# Altium schematic sheet Mega2560原理图.SchDoc: Atmega2560-AU
size 406 x 317 mm
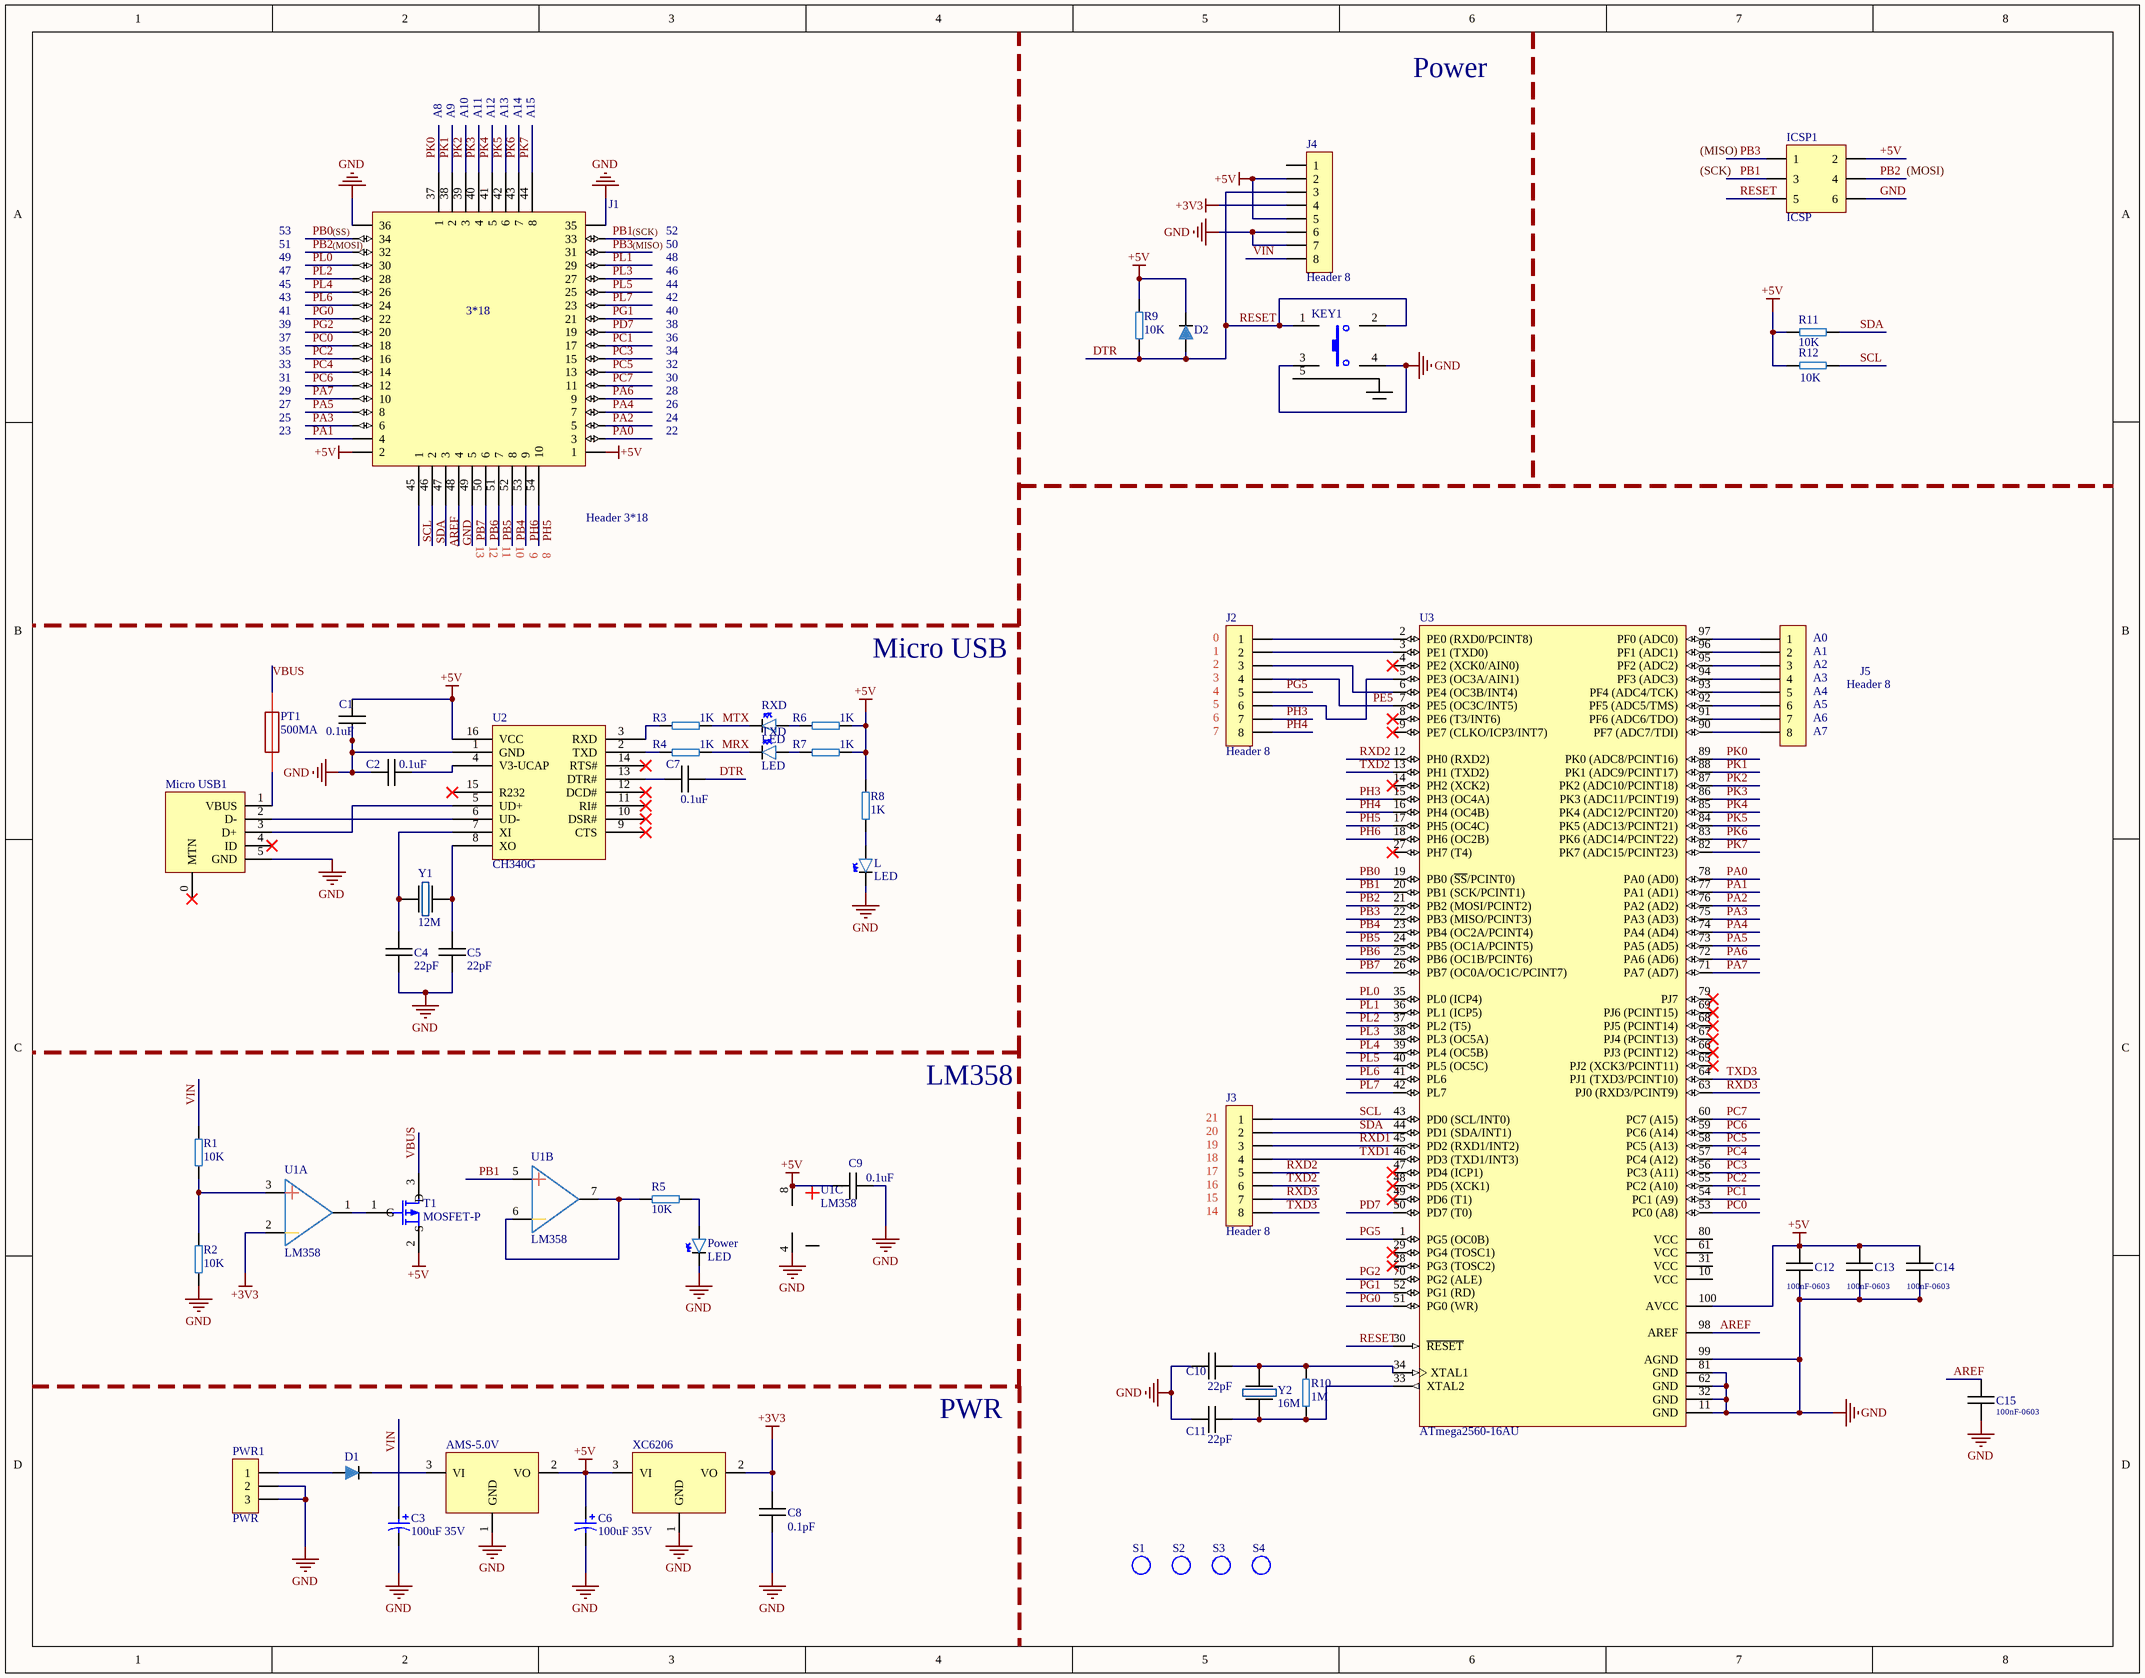
[diagram p0: Mega2560原理图.SchDoc]

## Parts
AMS-5.0V  AMS1117-5.0  [AMS1117-5.0v]  (value not drawn)
C1  0.1uF  [0805]
C2  0.1uF  [0805]
C3  100uF 35V  [极性电容]
C4  22pF  [0805]
C5  22pF  [0805]
C6  100uF 35V  [极性电容]
C7  0.1uF  [0805]
C8  0.1pF  [0805]
C9  0.1uF  [0805]
C10  22pF  [0805]
C11  22pF  [0805]
C12  100nF-0603  [0603_CAP]
C13  100nF-0603  [0603_CAP]
C14  100nF-0603  [0603_CAP]
C15  100nF-0603  [0603_CAP]
D1  二极管  [1206 正负]  (value not drawn)
D2  二极管  [1206 正负]  (value not drawn)
ICSP1  ICSP  [排针 2*3 PIN]
J1  Header 3*18  [排针 3*18 PIN]
J2  Header 8  [排针 8 PIN]
J3  Header 8  [排针 8 PIN]
J4  Header 8  [排针 8 PIN]
J5  Header 8  [排针 8 PIN]
KEY1  按键  [按键]  (value not drawn)
L  LED  [0805 - LED]
Micro_USB1  Micro USB  [MICRO-USB]  (value not drawn)
Power  LED  [0805 - LED]
PT1  500MA  [0805]
PWR1  PWR  [DC电源]
R1  10K  [0805]
R2  10K  [0805]
R3  1K  [0805]
R4  1K  [0805]
R5  10K  [0805]
R6  1K  [0805]
R7  1K  [0805]
R8  1K  [0805]
R9  10K  [0805]
R10  1M  [0805]
R11  10K  [0805]
R12  10K  [0805]
RXD  LED  [0805 - LED]
S1  散热孔  [散热孔]  (value not drawn)
S2  散热孔  [散热孔]  (value not drawn)
S3  散热孔  [散热孔]  (value not drawn)
S4  散热孔  [散热孔]  (value not drawn)
T1  MOSFET-P  [SI2301]
TXD  LED  [0805 - LED]
U1  LM358  [LM358]  (parts A,B,C of 3)
U2  CH340G  [CH340G]
U3  ATmega2560-16AU  [ATMEGA2560-AU]
XC6206  XC6206P332  [XC6206P332-3.3v]  (value not drawn)
Y1  12M  [贴片晶振]
Y2  16M  [贴片晶振]

## Nets
+3V3: C8.2 J4.4 U1.2 XC6206.2(VO)
+5V: AMS-5.0V.2(VO) C1.2 C6.1 C9.1 C12.2 C13.2 C14.2 D2.2 ICSP1.2 J1.1 J1.2 J4.2 J4.5 R6.2 R7.2 R8.2 R9.2 R11.2 R12.2 T1.2(S) U1.8 U2.16(VCC) U3.100(AVCC) XC6206.3(VI)
GND: AMS-5.0V.1(GND) C1.1 C2.1 C3.2 C4.1 C5.1 C6.2 C8.1 C9.2 C10.2 C11.2 C12.1 C13.1 C14.1 C15.1 ICSP1.6 J1.35 J1.36 J1.48(4) J4.6 J4.7 KEY1.3 KEY1.4 L.2 Micro_USB1.5(GND) Power.2 PWR1.2 PWR1.3 R2.1 U1.4 U2.1(GND) U3.11(GND) U3.32(GND) U3.62(GND) U3.81(GND) U3.99(AGND) XC6206.1(GND)
AREF: C15.2 J1.47(3) U3.98(AREF)
DTR: C7.1 D2.1 ICSP1.5 J4.3 KEY1.1 KEY1.2 R9.1 U3.30(~{RESET})  [also labelled RESET]
MRX: R4.2 TXD.2
MTX: R3.2 RXD.2
PA0: J1.3 U3.78(PA0_(AD0))
PA1: J1.4 U3.77(PA1_(AD1))
PA2: J1.5 U3.76(PA2_(AD2))
PA3: J1.6 U3.75(PA3_(AD3))
PA4: J1.7 U3.74(PA4_(AD4))
PA5: J1.8 U3.73(PA5_(AD5))
PA6: J1.9 U3.72(PA6_(AD6))
PA7: J1.10 U3.71(PA7_(AD7))
PB0: J1.34 U3.19(PB0_(~{SS}/PCINT0))
PB1: ICSP1.3 J1.33 U1.5 U3.20(PB1_(SCK/PCINT1))
PB2: ICSP1.4 J1.32 U3.21(PB2_(MOSI/PCINT2))
PB3: ICSP1.1 J1.31 U3.22(PB3_(MISO/PCINT3))
PB4: J1.52(8) U3.23(PB4_(OC2A/PCINT4))
PB5: J1.51(7) U3.24(PB5_(OC1A/PCINT5))
PB6: J1.50(6) U3.25(PB6_(OC1B/PCINT6))
PB7: J1.49(5) U3.26(PB7_(OC0A/OC1C/PCINT7))
PC0: J1.18 U3.53(PC0_(A8))
PC1: J1.17 U3.54(PC1_(A9))
PC2: J1.16 U3.55(PC2_(A10))
PC3: J1.15 U3.56(PC3_(A11))
PC4: J1.14 U3.57(PC4_(A12))
PC5: J1.13 U3.58(PC5_(A13))
PC6: J1.12 U3.59(PC6_(A14))
PC7: J1.11 U3.60(PC7_(A15))
PD7: J1.19 U3.50(PD7_(T0))
PE5: J2.4 U3.7(PE5_(OC3C/INT5))
PG0: J1.22 U3.51(PG0_(WR))
PG1: J1.21 U3.52(PG1_(RD))
PG2: J1.20 U3.70(PG2_(ALE))
PG5: J2.5 U3.1(PG5_(OC0B))
PH3: J2.7 U3.15(PH3_(OC4A))
PH4: J2.8 U3.16(PH4_(OC4B))
PH5: J1.54(10) U3.17(PH5_(OC4C))
PH6: J1.53(9) U3.18(PH6_(OC2B))
PK0: J1.37(1) U3.89(PK0_(ADC8/PCINT16))
PK1: J1.38(2) U3.88(PK1_(ADC9/PCINT17))
PK2: J1.39(3) U3.87(PK2_(ADC10/PCINT18))
PK3: J1.40(4) U3.86(PK3_(ADC11/PCINT19))
PK4: J1.41(5) U3.85(PK4_(ADC12/PCINT20))
PK5: J1.42(6) U3.84(PK5_(ADC13/PCINT21))
PK6: J1.43(7) U3.83(PK6_(ADC14/PCINT22))
PK7: J1.44(8) U3.82(PK7_(ADC15/PCINT23))
PL0: J1.30 U3.35(PL0_(ICP4))
PL1: J1.29 U3.36(PL1_(ICP5))
PL2: J1.28 U3.37(PL2_(T5))
PL3: J1.27 U3.38(PL3_(OC5A))
PL4: J1.26 U3.39(PL4_(OC5B))
PL5: J1.25 U3.40(PL5_(OC5C))
PL6: J1.24 U3.41(PL6)
PL7: J1.23 U3.42(PL7)
RXD1: J3.3 U3.45(PD2_(RXD1/INT2))
RXD2: J3.5 U3.12(PH0_(RXD2))
RXD3: J3.7 U3.63(PJ0_(RXD3/PCINT9))
SCL: J1.45(1) J3.1 R12.1 U3.43(PD0_(SCL/INT0))
SDA: J1.46(2) J3.2 R11.1 U3.44(PD1_(SDA/INT1))
TXD1: J3.4 U3.46(PD3_(TXD1/INT3))
TXD2: J3.6 U3.13(PH1_(TXD2))
TXD3: J3.8 U3.64(PJ1_(TXD3/PCINT10))
VBUS: PT1.2 T1.3(D)
VIN: C3.1 J4.8 R1.2
NetAMS-5.0V_3: AMS-5.0V.3(VI) D1.2
NetC2_2: C2.2 U2.4(V3-UCAP)
NetC4_2: C4.2 U2.7(XI) Y1.1
NetC5_2: C5.2 U2.8(XO) Y1.2
NetC7_2: C7.2 U2.13(DTR#)
NetC10_1: C10.1 R10.1 U3.34(XTAL1) Y2.1
NetC11_1: C11.1 R10.2 U3.33(XTAL2) Y2.2
NetD1_1: D1.1 PWR1.1
NetJ2_1: J2.1 U3.2(PE0_(RXD0/PCINT8))
NetJ2_2: J2.2 U3.3(PE1_(TXD0))
NetJ2_3: J2.3 U3.6(PE4_(OC3B/INT4))
NetJ2_6: J2.6 U3.5(PE3_(OC3A/AIN1))
NetJ5_1: J5.1 U3.97(PF0_(ADC0))
NetJ5_2: J5.2 U3.96(PF1_(ADC1))
NetJ5_3: J5.3 U3.95(PF2_(ADC2))
NetJ5_4: J5.4 U3.94(PF3_(ADC3))
NetJ5_5: J5.5 U3.93(PF4_(ADC4/TCK))
NetJ5_6: J5.6 U3.92(PF5_(ADC5/TMS))
NetJ5_7: J5.7 U3.91(PF6_(ADC6/TDO))
NetJ5_8: J5.8 U3.90(PF7_(ADC7/TDI))
NetL_1: L.1 R8.1
NetMicro_USB1_1: Micro_USB1.1(VBUS) PT1.1
NetMicro_USB1_2: Micro_USB1.2(D-) U2.6(UD-)
NetMicro_USB1_3: Micro_USB1.3(D+) U2.5(UD+)
NetPower_1: Power.1 R5.2
NetR1_1: R1.1 R2.2 U1.3
NetR3_1: R3.1 U2.3(RXD)
NetR4_1: R4.1 U2.2(TXD)
NetR5_1: R5.1 U1.6 U1.7
NetR6_1: R6.1 RXD.1
NetR7_1: R7.1 TXD.1
NetT1_1: T1.1(G) U1.1

Not connected (* = marked no-connect by the designer): J4 1; KEY1 5; Micro_USB1 0(MTN)* 4(ID)*; U2 9(CTS)* 10(DSR#)* 11(RI#)* 12(DCD#)* 14(RTS#)* 15(R232)*; U3 4(PE2_(XCK0/AIN0))* 8(PE6_(T3/INT6))* 9(PE7_(CLKO/ICP3/INT7))* 10(VCC) 14(PH2_(XCK2))* 27(PH7_(T4))* 28(PG3_(TOSC2))* 29(PG4_(TOSC1))* 31(VCC) 47(PD4_(ICP1))* 48(PD5_(XCK1))* 49(PD6_(T1))* 61(VCC) 65(PJ2_(XCK3/PCINT11))* 66(PJ3_(PCINT12))* 67(PJ4_(PCINT13))* 68(PJ5_(PCINT14))* 69(PJ6_(PCINT15))* 79(PJ7)* 80(VCC)

## Notes on the sheet
- Power
- A8
- A9
- A10
- A11
- A12
- A13
- A14
- A15
- (near ICSP1) (MISO)
- 53
- (near J1) (SS)
- (near J1) (SCK)
- 52
- (SCK)
- (MOSI)
- 45
- 47
- 49
- 51
- (near J1) (MOSI)
- (near J1) (MISO)
- 44
- 46
- 48
- 50
- 33
- 35
- 37
- 39
- 41
- 43
- 32
- 34
- 36
- 38
- 40
- 42
- 25
- 27
- 29
- 31
- 24
- 26
- 28
- 30
- 23
- 22
- 13
- 12
- 11
- 10
- 9
- 8
- Micro USB
- (near J2) 0
- (near J2) 1
- (near J2) 2
- (near J2) 3
- (near J2) 4
- (near J5) A0
- (near J5) A1
- (near J5) A2
- (near J5) A3
- (near J5) A4
- (near J2) 5
- (near J2) 6
- (near J2) 7
- (near J5) A5
- (near J5) A6
- (near J5) A7
- LM358
- (near J3) 21
- (near J3) 20
- (near J3) 19
- (near J3) 18
- (near J3) 17
- (near J3) 16
- (near J3) 15
- (near J3) 14
- PWR
- Title
- Size:
- Date:
- Number:
- Time:
- Revision:
- Sheet
- of
- File:
- (in symbol Header 3*18) 3*18

## Library data of the parts
C1 C2 C4 C5 C7 C9-C11 = CAP
C3 C6 = Cap Pol极性电容: 极性电容器; Published: 8-Jun-2000; LatestRevisionDate: 17-Jul-2002; LatestRevisionNote: Re-released for DXP Platform.; PackageReference: RB7.6-15; Publisher: Altium Limited; PackageDescription: Polarized Capacitor (Radial); 2 Leads
C8 = CAP电容
C12-C15 = CAP-0603: 0603 50V
ICSP1 = Header 2*3: 排针
J2-J5 = Header 8: 排针
KEY1 = 按键: Switch; Published: 24-Mar-1999; LatestRevisionDate: 17-Jul-2002; LatestRevisionNote: Re-released for DXP Platform.; PackageReference: SPST-2; Publisher: Altium Limited; PackageDescription: Switch; 2 Leads
PT1 = PT: 磁珠
R1-R10 = RES
R11 R12 = 电阻
T1 = MOSFET-P(MOS): 摩斯管; Published: 8-Jun-2000; LatestRevisionDate: 17-Jul-2002; LatestRevisionNote: Re-released for DXP Platform.; PackageVersion: 1995/1996; PackageReference: E3; Publisher: Altium Limited; PackageDescription: TO, Flat Index; 3 In-Line, Axial Leads; Body Dia. 4.6mm; Lead Dia. 0.5 mm (max)
U1 = LM358: 电源控制
U3 = ATmega2560-16AU: 8-bit AVR Microcontroller, 4.5-5.5V, 16MHz, 256KB Flash, 4KB EEPROM, 8KB SRAM, 86 GPIO pins, 100-pin TQFP, Industrial Grade (-40°C to 85°C), Pb-Free; DatasheetVersion: revN, May-2011; PackageVersion: revD, Oct-2010; PackageReference: 100A; PackageDescription: 100-Pin Thin Profile Plastic Quad Flat Pack (TQFP), 14 x 14 x 1.0 mm Body, 0.5 mm Pitch; Code_JEDEC: MS-026-AED; ComponentLink1Description: Manufacturer URL; ComponentLink1URL: http://www.atmel.com/; ComponentLink2Description: ATmega640/1280/1281/2560/2561 Datasheet; ComponentLink2URL: http://www.atmel.com/dyn/resources/prod_documents/doc2549.pdf; ComponentLink3Description: ATmega640/1280/1281/2560/2561 Summary; ComponentLink3URL: http://www.atmel.com/dyn/resources/prod_documents/2549S.pdf
Y1 Y2 = CRYSTAL